# EAGLE design FLQ01A (EAGLE 6.5.0)
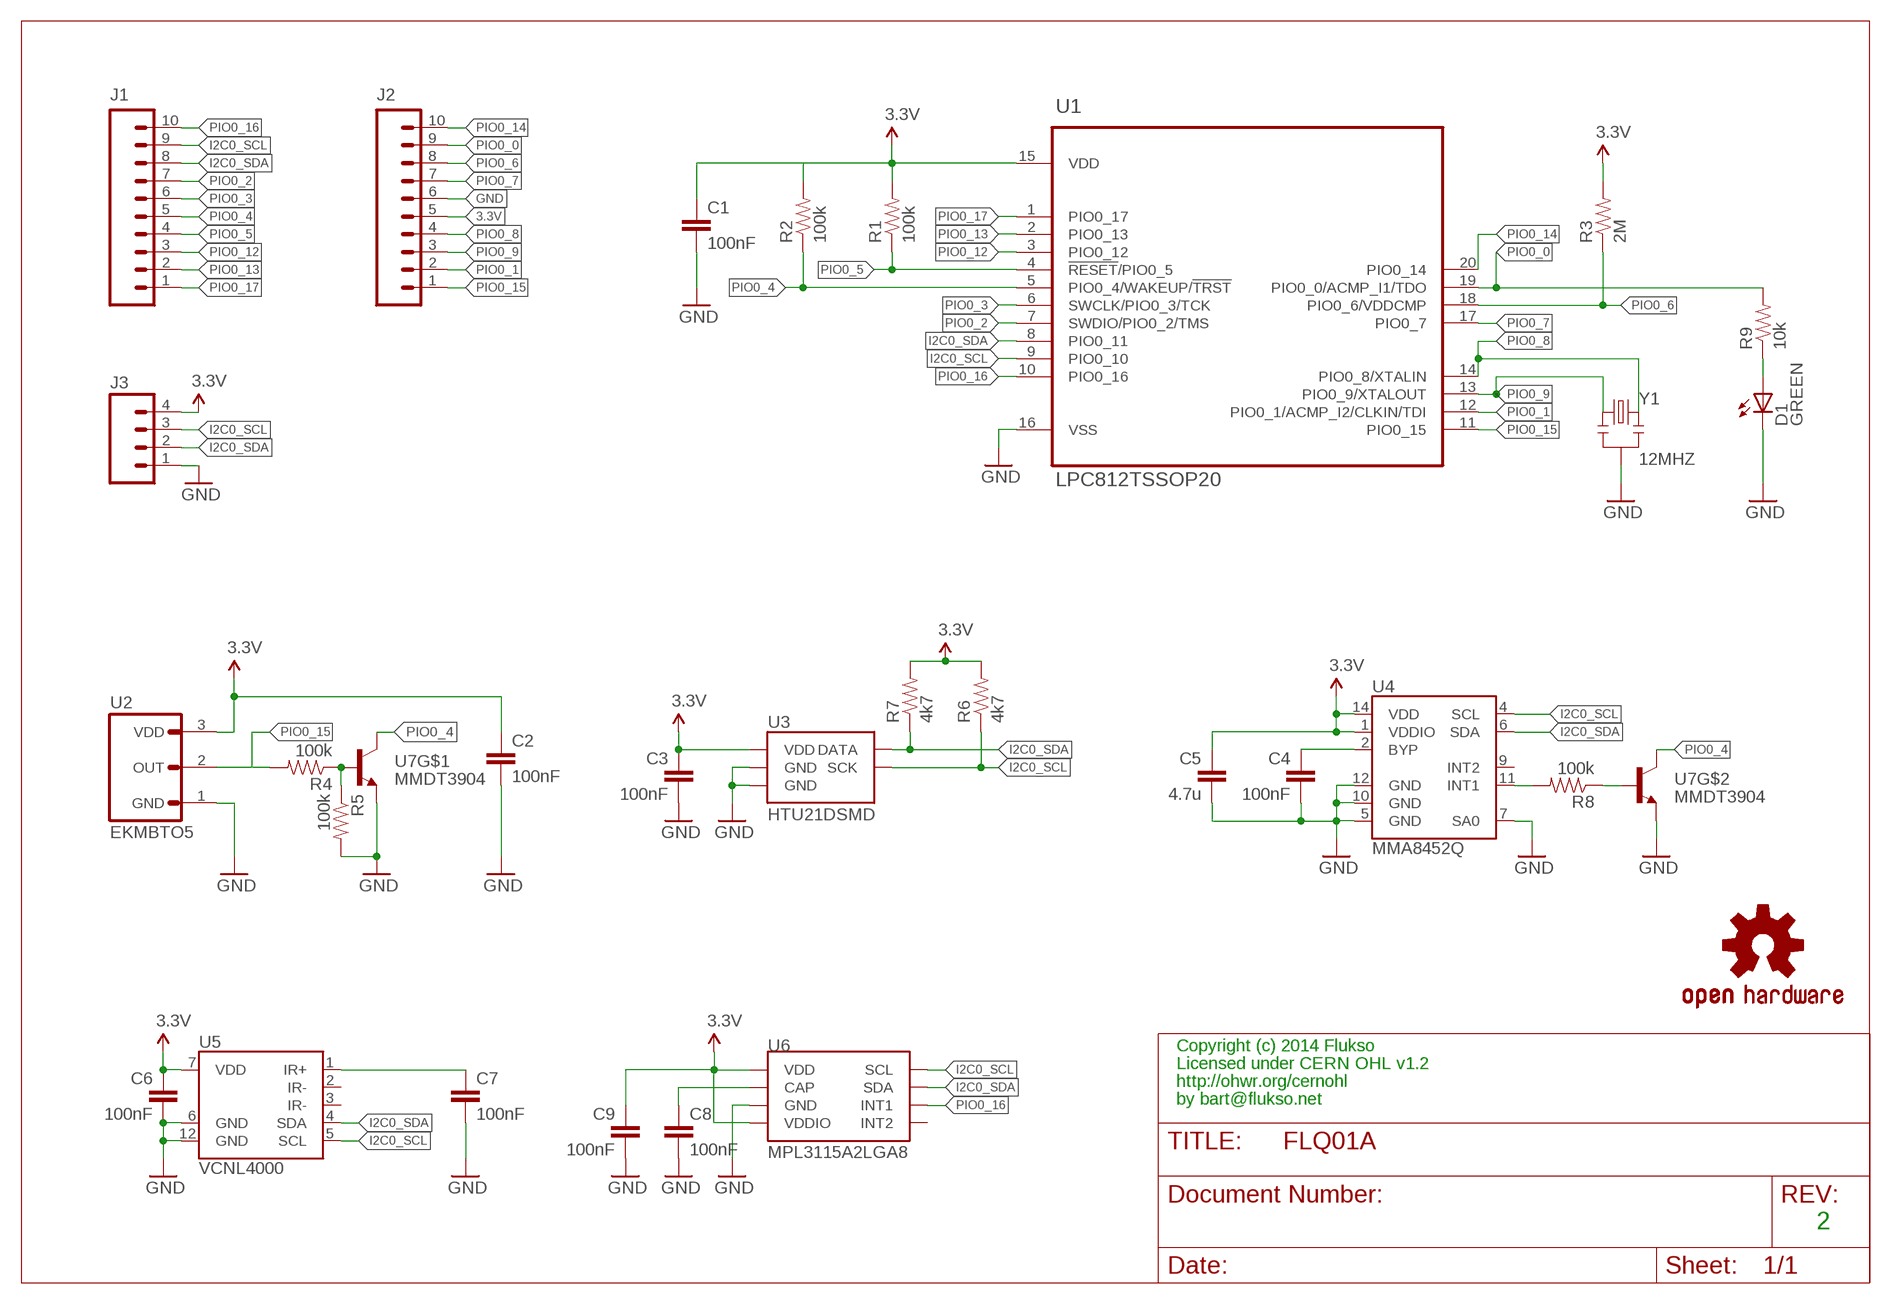
[diagram p0: schematic, sheet 1]

## Parts
C1  100nF  CAP0402-CAP  [0402-CAP]
C2  100nF  CAP0402-CAP  [0402-CAP]
C3  100nF  CAP0402-CAP  [0402-CAP]
C4  100nF  CAP0402-CAP  [0402-CAP]
C5  4.7u  CAP0603-CAP  [0603-CAP]
C6  100nF  CAP0402-CAP  [0402-CAP]
C7  100nF  CAP0402-CAP  [0402-CAP]
C8  100nF  CAP0402-CAP  [0402-CAP]
C9  100nF  CAP0402-CAP  [0402-CAP]
D1  GREEN  LED-GREEN0603  [LED-0603]
J1  M10SMD_MALE  [1X10_SMD_MALE]
J2  M10SMD_MALE  [1X10_SMD_MALE]
J3  M041X04_NO_SILK  [1X04_NO_SILK]
R1  100k  RESISTOR0402-RES  [0402-RES]
R2  100k  RESISTOR0402-RES  [0402-RES]
R3  2M  RESISTOR0402-RES  [0402-RES]
R4  100k  RESISTOR0402-RES  [0402-RES]
R5  100k  RESISTOR0402-RES  [0402-RES]
R6  4k7  RESISTOR0402-RES  [0402-RES]
R7  4k7  RESISTOR0402-RES  [0402-RES]
R8  100k  RESISTOR0402-RES  [0402-RES]
R9  10k  RESISTOR0402-RES  [0402-RES]
U1  LPC812TSSOP20  [TSSOP20]
U2  EKMBTO5  [TO5]
U3  HTU21DSMD  [HTU21D]
U4  MMA8452Q  [QFN-16_0.5MM]
U5  VCNL4000  [VCNL4000]
U6  MPL3115A2LGA8  [LGA8]
U7  MMDT3904  [SOT363]
U$1  OSHW-LOGOS  [OSHW-LOGO-S]
Y1  12MHZ  RESONATOR8MHZ  [RESONATOR-SMD]

## Nets
3.3V: C1.1 C2.1 C3.1 C5.1 C6.1 C9.1 J2.5 J3.4 R1.2 R2.2 R3.2 R6.2 R7.2 U1.15(VDD) U2.3(VDD) U3.VDD U4.1(VDDIO) U4.14(VDD) U5.7(VDD) U6.1(VDD) U6.4(VDDIO)
GND: C1.2 C2.2 C3.2 C4.2 C5.2 C6.2 C7.2 C8.2 C9.2 D1.C J2.6 J3.1 R5.2 U1.16(VSS) U2.1(GND) U3.7(GND) U3.GND U4.5(GND) U4.7(SA0) U4.10(GND) U4.12(GND) U5.6(GND) U5.12(GND) U7.1(E) U7.4(E) Y1.2
I2C0_SCL: J1.9 J3.3 R6.1 U1.9(PIO0_10) U3.SCK U4.4(SCL) U5.5(SCL) U6.8(SCL)
I2C0_SDA: J1.8 J3.2 R7.1 U1.8(PIO0_11) U3.DATA U4.6(SDA) U5.4(SDA) U6.7(SDA)
N$1: C7.1 U5.1(IR+)
N$2: R4.1 R5.1 U7.5(B)
N$3: C4.1 U4.2(BYP)
N$4: R8.2 U4.11(INT1)
N$5: R8.1 U7.2(B)
N$6: C8.1 U6.2(CAP)
N$7: U6.3(GND) ; supply symbol labelled GND
N$8: D1.A R9.1
PIO0_0: J2.9 R9.2 U1.19(PIO0_0/ACMP_I1/TDO)
PIO0_1: J2.2 U1.12(PIO0_1/ACMP_I2/CLKIN/TDI)
PIO0_2: J1.7 U1.7(SWDIO/PIO0_2/TMS)
PIO0_3: J1.6 U1.6(SWCLK/PIO0_3/TCK)
PIO0_4: J1.5 R2.1 U1.5(PIO0_4/WAKEUP/!TRST!) U7.3(C) U7.6(C)
PIO0_5: J1.4 R1.1 U1.4(!RESET!/PIO0_5)
PIO0_6: J2.8 R3.1 U1.18(PIO0_6/VDDCMP)
PIO0_7: J2.7 U1.17(PIO0_7)
PIO0_8: J2.4 U1.14(PIO0_8/XTALIN) Y1.3
PIO0_9: J2.3 U1.13(PIO0_9/XTALOUT) Y1.1
PIO0_12: J1.3 U1.3(PIO0_12)
PIO0_13: J1.2 U1.2(PIO0_13)
PIO0_14: J2.10 U1.20(PIO0_14)
PIO0_15: J2.1 R4.2 U1.11(PIO0_15) U2.2(OUT)
PIO0_16: J1.10 U1.10(PIO0_16) U6.6(INT1)
PIO0_17: J1.1 U1.1(PIO0_17)
Unconnected: U4.9(INT2) U5.2(IR-) U5.3(IR-) U6.5(INT2)

## Notes on the sheet
- Copyright (c) 2014 Flukso
- Licensed under CERN OHL v1.2
- http://ohwr.org/cernohl
- by bart@flukso.net
- 2

## Library data of the parts
C1-C9 = flukso:CAP: Capacitor Standard 0603 ceramic capacitor, and 0.1" leaded capacitor.
D1 = SparkFun-LED:LED-GREEN: Various green LEDs 0603- DIO-00821 LARGE- DIO-00862 LILYPAD- DIO-09910; PROD_ID: DIO-00821
J1 J2 = flukso:M10: Header 10 Standard 10-pin 0.1" header. Use with straight break away headers (SKU : PRT-00116), right angle break away headers (PRT-00553), swiss pins (PRT-00743), machine pins (PRT-00117), and female headers (PRT-00115).; PROD_ID: CONN-11291
J3 = SparkFun-Connectors:M04: Header 4 Standard 4-pin 0.1" header. Use with straight break away headers (SKU : PRT-00116), right angle break away headers (PRT-00553), swiss pins (PRT-00743), machine pins (PRT-00117), and female headers (PRT-00115). Molex polarized connector foot print use with SKU : PRT-08231 with associated crimp pins and housings. 1MM SMD Version SKU: PRT-10208
R1-R9 = SparkFun-Passives:RESISTOR: Resistor Basic schematic elements and footprints for 0603, 1206, and PTH resistors.
U1 = flukso:LPC812: IC, 32-bit ARM Cortex-M0+ microcontroller 16 kB flash and 4 kB SRAM
U2 = flukso:EKMB
U3 = flukso:HTU21D
U4 = SparkFun-Sensors:MMA8452Q: MMA8452Q 3-Axis, 12/8-bit Digital Accelerometer Supply Voltage: 1.6-3.6V Range: +/- 2g, 4g, 8g Interface: I2C, 12-bit and 8-bit ODR: 1.56 Hz - 800 Hz Package: QFN-16 http://cache.freescale.com/files/sensors/doc/data_sheet/MMA8452Q.pdf; PROD_ID: IC-10769
U5 = SparkFun-Sensors:VCNL4000: Fully integrated proximity and ambient light sensor with infrared emitter and I2C interface
U6 = SparkFun-Sensors:MPL3115A2: Altimeter/Pressure Sensor, I2C, 1.95V-3.6V supply, 50 to 110kPa
U7 = SparkFun-DiscreteSemi:MMDT3904: Dual NPN transistor
U$1 = sparkFun:OSHW-LOGO: Open Source Hardware Logo This logo indicates the piece of hardware it is found on incorporates a OSHW license and/or adheres to the definition of open source hardware found here: http://freedomdefined.org/OSHW
Y1 = SparkFun-FreqCtrl:RESONATOR: Resonator Small SMD resonator. Used, eg, on the Arduino Pro/ Pro Mini boards. 8MHz- XTAL-08895 16MHz- XTAL-08900; PROD_ID: XTAL-08895; VALUE: 8MHZ

## Net classes
0 default: width 0.2 mm
1 power: width 0.305 mm

## Board
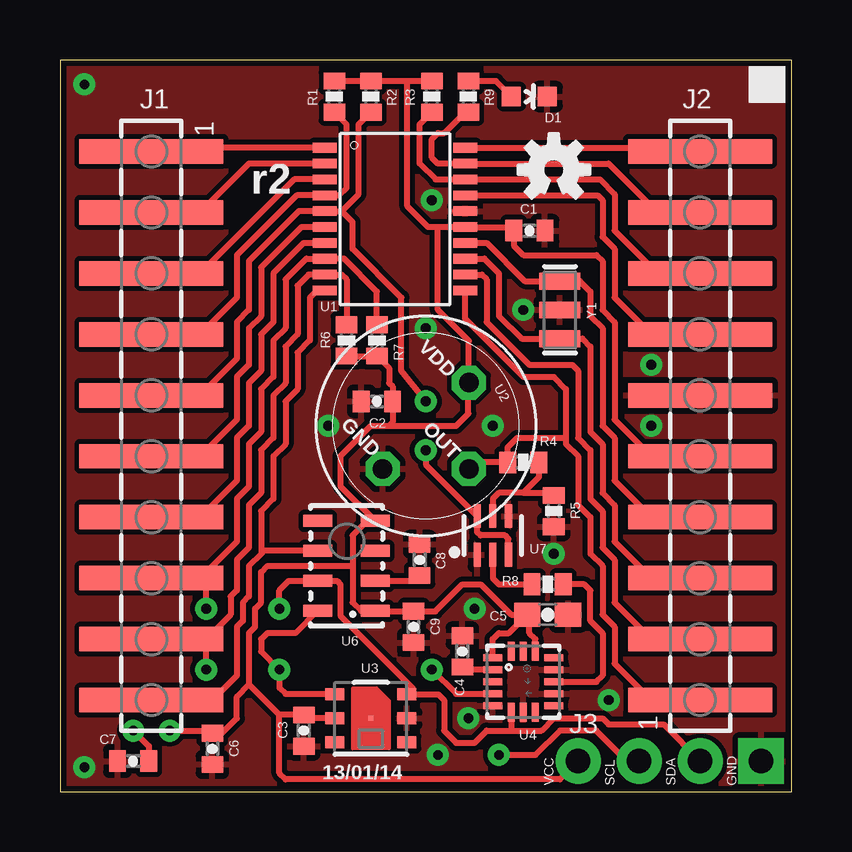
[diagram p1: board, top side]
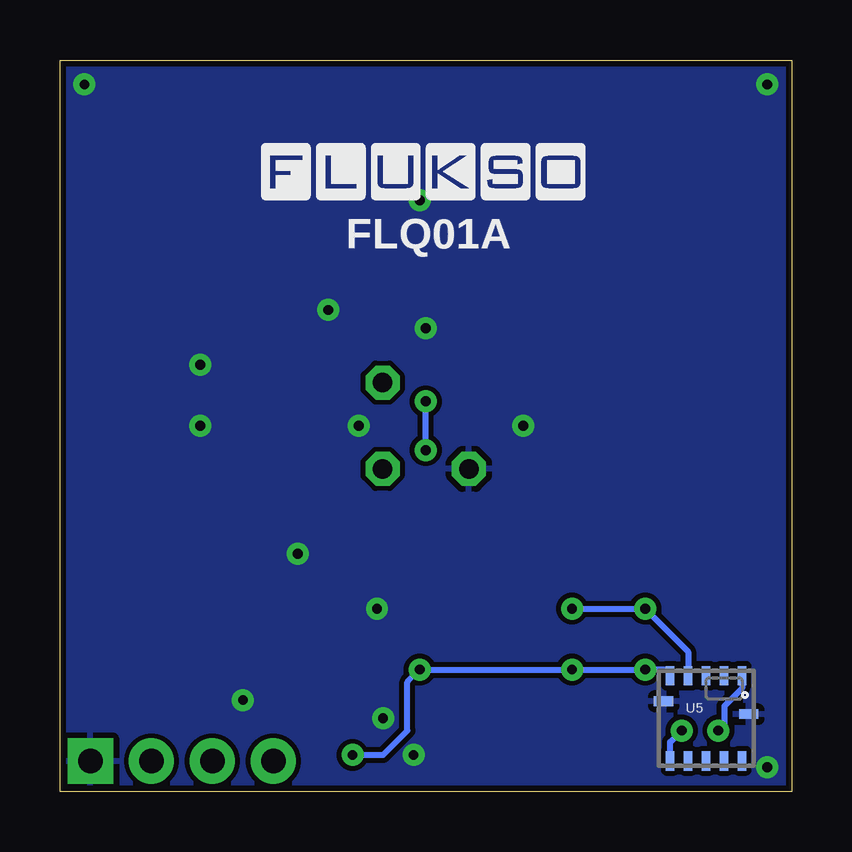
[diagram p2: board, bottom side, seen from below]

Size 30.48 x 30.48 mm. Coordinates in mm from the lower left corner, seen from the top.
Outline: 0,0 30.48,0 30.48,30.48 0,30.48 0,0
Copper layers (1*16): Top 0.035mm / dielectric 1.5mm / Bottom 0.035mm
Design rules "sparkfun": minimum track width 8mil, minimum drill 16mil, track to track 8mil, track to pad 8mil, pad to pad 8mil, via to via 8mil, smd to smd 8mil, copper to edge 10mil, drill to drill 8mil, minimum pad ring 12mil, minimum via ring 10mil, stop-mask expansion 4mil, vias tented up to drill 25mil, thermal gap 10mil

### Footprints (pad centres in the part's own frame; a part is rotated, then mirrored left to right if it is on the bottom)
0402-CAP = smd 0.7 x 0.9: 1 -0.65,0; 2 0.65,0
0603-CAP = smd 1.1 x 1: 1 -0.85,0; 2 0.85,0
LED-0603 = smd 0.8 x 0.8: A 0,-0.75; C 0,0.75
1X10_SMD_MALE = smd 1.02 x 6: 1 0,0; 2 2.54,0; 3 5.08,0; 4 7.62,0; 5 10.16,0; 6 12.7,0; 7 15.24,0; 8 17.78,0; 9 20.32,0; 10 22.86,0
1X04_NO_SILK = drill 1.016 pad 1.88 square: 1 0,0 | drill 1.016 pad 1.88: 2 2.54,0; 3 5.08,0; 4 7.62,0
0402-RES = smd 0.7 x 0.9: 1 -0.65,0; 2 0.65,0
TSSOP20 = smd 1 x 0.4: 1 -2.937,2.693; 2 -2.937,2.032; 3 -2.937,1.372; 4 -2.937,0.712; 5 -2.937,0.051; 6 -2.937,-0.609; 7 -2.937,-1.27; 8 -2.943,-1.93; 9 -2.937,-2.59; 10 -2.937,-3.251; 11 2.905,-3.251; 12 2.905,-2.59; 13 2.911,-1.93; 14 2.905,-1.27; 15 2.905,-0.609; 16 2.905,0.051; 17 2.905,0.712; 18 2.905,1.372; 19 2.905,2.032; 20 2.905,2.693
TO5 = drill 0.813 octagon: 1 0,-2.54; 2 2.54,0; 3 0,2.54
HTU21D = smd 0.2 x 0.2: 7 0,0 | smd 0.8 x 0.5: DATA -1.5,-1; GND -1.5,0; NC@1 -1.5,1; NC@6 1.5,1; SCK 1.5,-1; VDD 1.5,0
QFN-16_0.5MM = smd 0.8 x 0.3: 1 -1.275,1; 2 -1.275,0.5; 3 -1.275,0; 4 -1.275,-0.5; 5 -1.275,-1; 9 1.275,-1; 10 1.275,-0.5; 11 1.275,0; 12 1.275,0.5; 13 1.275,1 | smd 0.3 x 0.8: 6 -0.5,-1.275; 7 0,-1.275; 8 0.5,-1.275; 14 0.5,1.275; 15 0,1.275; 16 -0.5,1.275
VCNL4000 = smd 0.35 x 0.805: 1 -1.5,-1.772; 2 -0.75,-1.772; 3 0,-1.772; 4 0.75,-1.772; 5 1.5,-1.772; 7 1.5,1.772; 8 0.75,1.772; 9 0,1.772; 10 -0.75,1.772; 11 -1.5,1.772 | smd 0.805 x 0.4: 6 1.772,-0.715; 12 -1.772,-0.175
LGA8 = smd 1.2 x 0.5: 1 -1.2,1.875; 2 -1.2,0.625; 3 -1.2,-0.625; 4 -1.2,-1.875; 5 1.2,-1.875; 6 1.2,-0.625; 7 1.2,0.625; 8 1.2,1.875
SOT363 = smd 0.3 x 0.99: 1 -0.65,-0.8; 2 0,-0.8; 3 0.65,-0.8; 4 0.65,0.81; 5 0,0.81; 6 -0.65,0.81
RESONATOR-SMD = smd 0.7 x 1.7: 1 -1.2,0; 2 0,0; 3 1.2,0

### Placement (x,y rotation side)
C1  19.56,23.37 0 top
C2  13.21,16.26 180 top
C3  10.16,2.54 270 top
C4  16.76,5.84 90 top
C5  20.32,7.37 0 top
C6  6.35,1.78 270 top
C7  3.05,1.27 180 top
C8  14.99,9.65 90 top
C9  14.73,6.86 270 top
D1  19.56,28.96 270 top
J1  3.81,26.67 270 top
J2  26.67,3.81 90 top
J3  29.21,1.27 180 top
R1  11.43,28.96 90 top
R2  12.95,28.96 90 top
R3  15.49,28.96 90 top
R4  19.3,13.72 180 top
R5  20.57,11.68 270 top
R6  11.94,18.8 270 top
R7  13.21,18.8 270 top
R8  20.32,8.64 0 top
R9  17.02,28.96 270 top
U1  13.97,24.13 0 top
U2  15.24,15.24 315 top
U3  12.95,3.05 180 top
U4  19.3,4.57 0 top
U5  3.56,3.05 180 bottom
U6  11.94,9.4 180 top
U7  18.03,10.67 0 top
U$1  20.57,25.91 0 top
U$2  [FLUKSO_LOGO_MEDIUM]  22.1,24.64 0 bottom
Y1  20.83,20.07 90 top

### Tracks (layer width: path | path; a pad name or v marks a point on that pad's centre or on a via)
3.3V  (via drill 0.41 pad 0.61)
  Top 0.254: J2.5 24.64,13.97 23.11,15.49 23.11,19.56 22.61,20.07 22.61,22.1 22.35,22.35 19.3,22.35 18.91,22.75 C1.1 18.75,23.52 U1.15 15.75,23.52 | R1.2 R2.2 14.48,29.61 | 15.75,23.52 15.34,23.52 14.48,24.38 14.48,29.61 | 14.48,29.61 R3.2 | 12.19,9.4 12.19,10.67 12.8,11.27 U6.4 11.68,12.73 11.68,13.97 12.95,15.24 13.72,15.24 | 12.19,9.4 12.19,7.87 12.54,7.52 U6.1 12.9,7.51 C9.1 15.64,7.51 16.76,8.64 17.53,8.64 18.8,7.37 C5.1 | R6.2 R7.2 13.72,17.64 13.72,17.02 13.86,16.88 C2.1 13.86,15.38 13.72,15.24 | 12.19,9.4 8.64,9.4 8.38,9.14 8.38,7.87 8.13,7.62 8.13,6.86 7.87,6.6 7.87,4.46 | 15.75,23.52 15.75,20.07 17.04,18.78 U2.3 17.02,17.02 17.02,15.75 16.51,15.24 13.72,15.24 | 19.56,7.37 C5.1 | J3.4 20.83,0.51 9.4,0.51 9.14,0.76 9.14,3.19 | U3.VDD 10.56,3.05 C3.1 9.14,3.19 | U4.14 19.8,6.36 19.56,6.6 19.56,7.28 C5.1 | U4.1 18.03,6.34 18.29,6.6 18.71,6.6 C5.1 | 7.87,4.46 9.14,3.19 | 7.87,4.46 7.37,3.95 7.37,3.05 6.75,2.43 C6.1 6.24,2.54 v4.57,2.54
  Bottom 0.254: U5.7 5.06,2.06 v4.57,2.54
GND  (via drill 0.41 pad 0.61)
  Top 0.254: 16.46,24.18 U1.16
  other vias: 19.3,20.07 15.49,24.64 24.64,17.78 24.64,15.24 1.02,29.46 29.46,29.46 1.02,1.02 22.86,3.81 15.24,19.3 18.03,15.24 20.57,9.91 11.18,15.24 17.27,7.62 15.75,1.52 17.02,3.05
  pour Top: 0,0 0,30.48 30.48,30.48 30.48,0
  pour Bottom: 0,0 0,30.48 30.48,30.48 30.48,0
I2C0_SCL  (via drill 0.41 pad 0.61)
  Top 0.254: 5.97,6.22 5.84,6.35 J1.9 | 5.97,6.22 6.1,6.1 v6.1,5.08 | R6.1 11.94,21.34 11.73,21.54 U1.9 10.36,21.54 9.91,21.08 9.91,19.05 9.4,18.54 9.4,17.02 8.89,16.51 8.89,14.73 8.38,14.22 8.38,12.45 7.87,11.94 7.87,10.16 7.37,9.65 7.37,8.38 7.11,8.13 7.11,7.37 5.97,6.22 | v15.49,5.08 16.5,4.07 U4.4 | U6.8 9.82,6.6 8.64,6.6 8.38,6.35 8.38,5.84 v9.14,5.08 9.14,4.32 9.4,4.06 11.44,4.06 U3.SCK | J3.3 23.62,1.27 22.35,2.54 20.83,2.54 19.81,1.52 v18.29,1.52
  Bottom 0.254: U5.5 5.06,5.08 v6.1,5.08 v9.14,5.08 v15.49,5.08 16,4.57 16,2.54 17.02,1.52 v18.29,1.52
I2C0_SDA  (via drill 0.41 pad 0.61)
  Top 0.254: 5.84,8.89 7.37,10.41 7.37,12.19 7.87,12.7 7.87,14.48 8.38,14.99 8.38,16.76 8.89,17.27 8.89,18.8 9.4,19.3 9.4,21.34 10.26,22.2 U1.8 11.84,22.2 13.21,20.83 R7.1 | 5.84,8.89 J1.8 | v6.1,7.62 6.1,8.64 5.84,8.89 | J3.2 25.15,2.79 22.86,2.79 22.61,3.05 20.57,3.05 20.07,2.54 18.8,2.54 | 18.8,2.54 17.78,2.54 17.27,2.03 16.51,2.03 16,2.54 16,3.81 15.76,4.05 U3.DATA 14.71,4.3 11.68,7.33 11.68,8.64 11.55,8.77 U6.7 9.54,8.77 9.14,8.38 v9.14,7.62 | U4.6 18.8,2.55 18.8,2.54
  Bottom 0.254: U5.4 4.31,5.83 v6.1,7.62 v9.14,7.62
N$1  (via drill 0.41 pad 0.61)
  Top 0.254: v3.05,2.54 3.7,1.89 C7.1
  Bottom 0.254: U5.1 2.06,4.29 2.79,3.56 2.79,2.79 v3.05,2.54
N$2
  Top 0.254: R4.1 19.95,13.1 19.3,12.45 | 19.3,12.45 18.29,12.45 18.03,12.19 U7.5 | 19.3,12.45 20.46,12.45 R5.1
N$3
  Top 0.254: U4.2 16.88,5.07 C4.1
N$4
  Top 0.254: R8.2 21.84,8.64 22.1,8.38 22.1,7.11 22.61,6.6 22.61,4.83 22.35,4.57 U4.11
N$5
  Top 0.254: U7.2 18.03,8.89 18.29,8.64 R8.1
N$6
  Top 0.254: 14.71,8.77 C8.1 14.76,8.77 U6.2
N$8
  Top 0.254: R9.1 18.16,29.61 D1.A
PIO0_0
  Top 0.254: J2.9 24.89,24.13 22.86,26.16 U1.19 15.75,26.16 15.49,26.42 15.49,27.18 15.75,27.43 16,27.43 16.88,28.31 R9.2
PIO0_1
  Top 0.254: U1.12 17.58,21.54 17.78,21.34 17.78,19.56 19.56,17.78 21.34,17.78 21.59,17.53 21.59,14.73 22.1,14.22 22.1,12.19 22.61,11.68 22.61,10.16 23.11,9.65 23.11,7.87 24.64,6.35 J2.2
PIO0_2
  Top 0.254: U1.7 10.16,22.86 8.89,21.59 8.89,19.56 8.38,19.05 8.38,17.53 7.87,17.02 7.87,15.24 7.37,14.73 7.37,12.95 5.84,11.43 J1.7
PIO0_3
  Top 0.254: U1.6 10.06,23.52 8.38,21.84 8.38,19.81 7.87,19.3 7.87,17.78 7.37,17.27 7.37,15.49 5.84,13.97 J1.6
PIO0_4  (via drill 0.41 pad 0.61)
  Top 0.254: J1.5 5.84,16.51 7.37,18.03 7.37,19.56 7.87,20.07 7.87,22.1 9.96,24.18 U1.5 11.73,24.18 | 11.73,24.18 12.45,24.89 12.45,27.8 R2.1 | U7.3 18.68,10.53 18.54,10.67 17.53,10.67 17.38,10.81 U7.6 15.24,13.62 v15.24,14.22 | 11.73,24.18 12.19,23.72 12.19,22.61 14.22,20.57 14.22,17.53 v15.24,16.26
  Bottom 0.254: v15.24,14.22 v15.24,16.26
PIO0_5
  Top 0.254: 3.3,19.05 J1.4 5.84,19.05 7.37,20.57 7.37,22.35 9.86,24.84 U1.4 11.63,24.84 11.94,25.15 11.94,27.8 R1.1
PIO0_6
  Top 0.254: J2.8 24.89,21.59 23.11,23.37 23.11,24.89 22.5,25.5 U1.18 15.65,25.5 14.99,26.16 14.99,27.8 R3.1
PIO0_7
  Top 0.254: U1.17 22.4,24.84 22.61,24.64 22.61,23.11 23.11,22.61 23.11,20.57 24.64,19.05 J2.7
PIO0_8
  Top 0.254: J2.4 24.64,11.43 23.11,12.95 23.11,14.73 22.61,15.24 22.61,19.3 22.1,19.81 22.1,20.83 21.66,21.27 Y1.3 19.37,21.27 17.78,22.86 U1.14
PIO0_9
  Top 0.254: U1.13 17.68,22.2 18.29,21.59 18.29,19.81 19.23,18.87 Y1.1 21.77,18.87 22.1,18.54 22.1,14.99 22.61,14.48 22.61,12.45 23.11,11.94 23.11,10.41 24.64,8.89 J2.3
PIO0_12
  Top 0.254: U1.3 9.75,25.5 5.84,21.59 J1.3
PIO0_13
  Top 0.254: U1.2 7.87,26.16 5.84,24.13 J1.2
PIO0_14
  Top 0.254: U1.20 26.52,26.82 J2.10
PIO0_15
  Top 0.254: 16.97,20.88 U1.11 16.88,19.7 19.3,17.27 20.57,17.27 21.08,16.76 21.08,14.73 | 21.08,14.73 21.08,14.48 21.59,13.97 21.59,11.94 22.1,11.43 22.1,9.91 22.61,9.4 22.61,7.37 23.11,6.86 23.11,5.33 24.64,3.81 J2.1 25.15,3.81 | U2.2 17.31,13.72 R4.2 18.65,14.34 19.05,14.73 21.08,14.73
PIO0_16
  Top 0.254: U1.10 10.72,20.88 10.41,20.57 10.41,18.8 9.91,18.29 9.91,16.76 9.4,16.26 9.4,14.48 8.89,13.97 8.89,12.19 8.38,11.68 8.38,9.91 | 8.38,9.91 7.87,9.4 7.87,8.13 7.62,7.87 7.62,7.11 7.37,6.86 7.37,4.83 6.35,3.81 J1.10 | U6.6 8.5,10.02 8.38,9.91
PIO0_17
  Top 0.254: U1.1 3.96,26.82 J1.1

### Text on the board
tPlace: r2 | U7 | 13/01/14 | VCC | SCL | SDA | GND
bPlace: FLQ01A